# EasyEDA Pro project 灯光画控制板.epro

# Schematic 灯光画控制板
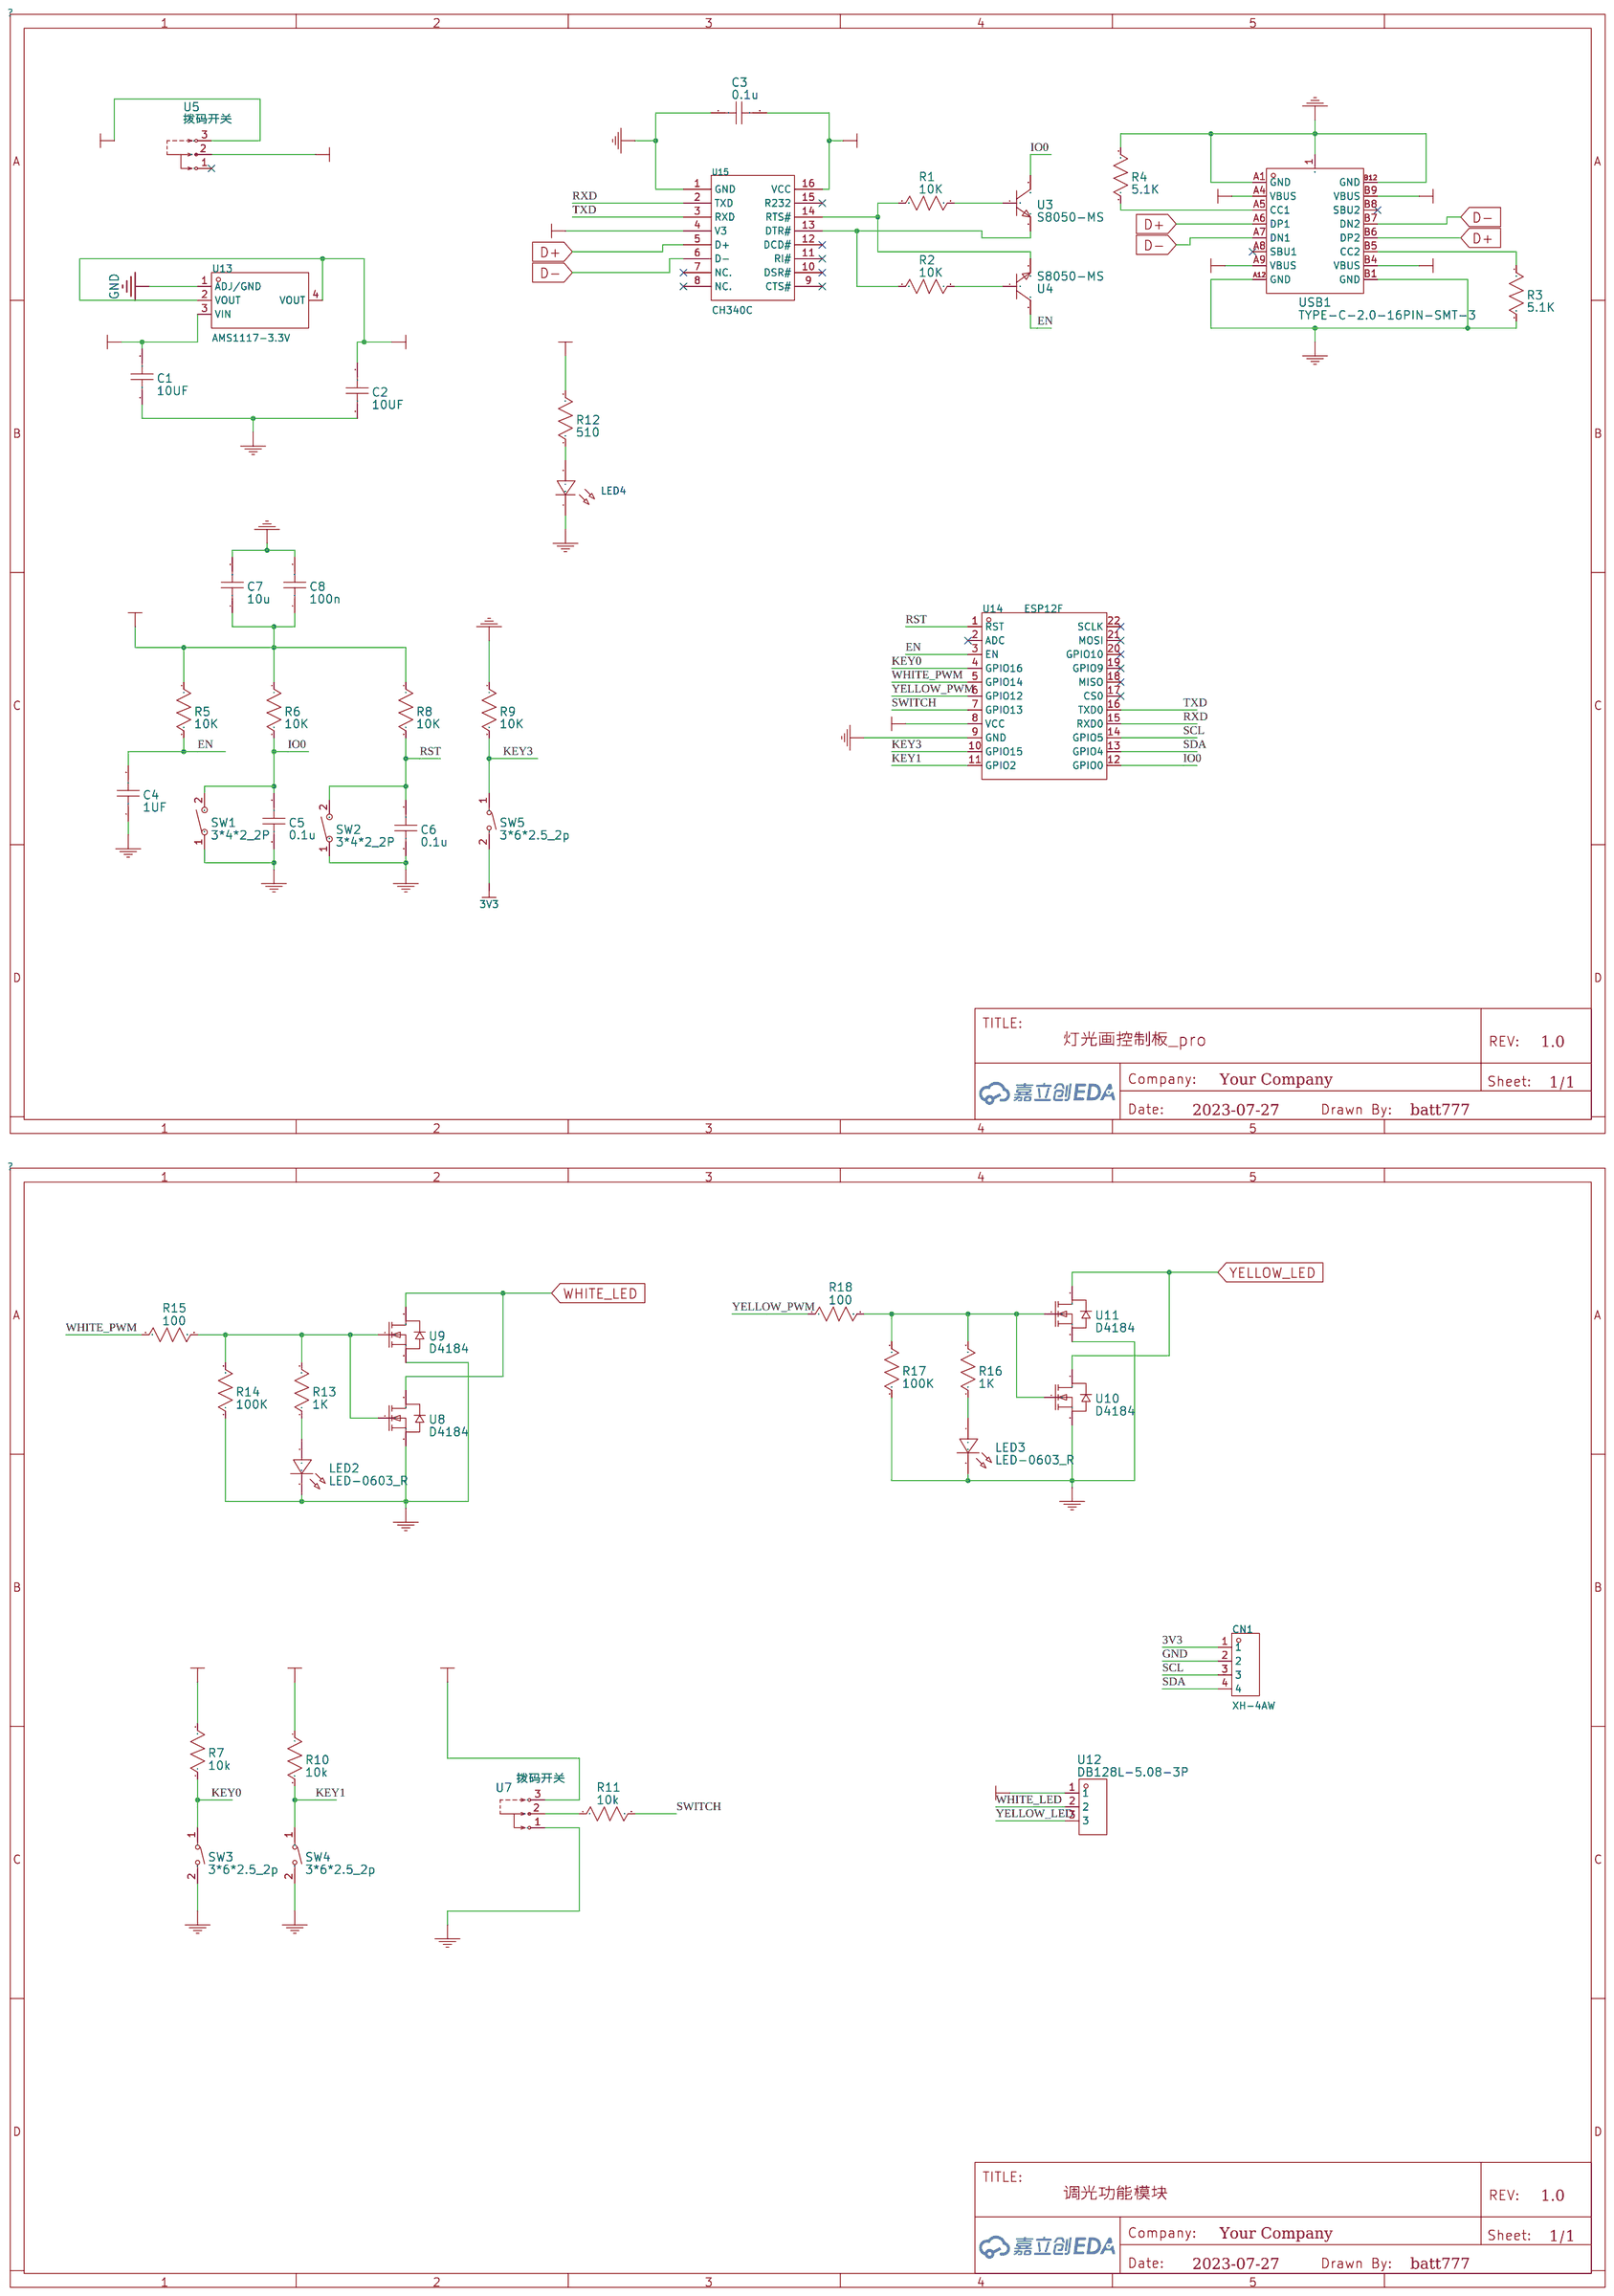
[diagram p0: schematic sheet]

## Parts
C1  10UF  [C0603]
C2  10UF  [C0603]
C3  0.1u  [C0603]
C4  1UF  [C0603]
C5  0.1u  [C0603]
C6  0.1u  [C0603]
C7  10u  [C0603]
C8  100n  [C0603]
CN1  XH-4AW  [CONN-TH_XH-4AW]
LED2  LED-0603_R  [LED0603_RED]
LED3  LED-0603_R  [LED0603_RED]
LED4  -  [LED_0603]
R1  10K  [R0603]
R2  10K  [R0603]
R3  5.1K  [R0603]
R4  5.1K  [R0603]
R5  10K  [R0603]
R6  10K  [R0603]
R7  10k  [R0603]
R8  10K  [R0603]
R9  10K  [R0603]
R10  10k  [R0603]
R11  10k  [R0603]
R12  510  [R0603]
R13  1K  [R0603]
R14  100K  [R0603]
R15  100  [R0603]
R16  1K  [R0603]
R17  100K  [R0603]
R18  100  [R0603]
SW1  3*4*2_2P  [SW-SMD_L4.0-W2.9-LS5.0]
SW2  3*4*2_2P  [SW-SMD_L4.0-W2.9-LS5.0]
SW3  3*6*2.5_2p  [SW-SMD_L6.1-W3.5-LS8.0]
SW4  3*6*2.5_2p  [SW-SMD_L6.1-W3.5-LS8.0]
SW5  3*6*2.5_2p  [SW-SMD_L6.1-W3.5-LS8.0]
U3  S8050-MS  [SOT-23-3_L2.9-W1.3-P1.90-LS2.4-BR]
U4  S8050-MS  [SOT-23-3_L2.9-W1.3-P1.90-LS2.4-BR]
U5  拨码开关  [SW-TH_SHOU-HAN_SS12D10G4]
U7  拨码开关  [SW-TH_SHOU-HAN_SS12D10G4]
U8  D4184  [TO-252-3_L6.6-W6.1-P4.57-LS9.9-BR-CW]
U9  D4184  [TO-252-3_L6.6-W6.1-P4.57-LS9.9-BR-CW]
U10  D4184  [TO-252-3_L6.6-W6.1-P4.57-LS9.9-BR-CW]
U11  D4184  [TO-252-3_L6.6-W6.1-P4.57-LS9.9-BR-CW]
U12  DB128L-5.08-3P  [CONN-TH_DB128L-5.08-3P]
U13  AMS1117-3.3V  [SOT-223-4_L6.5-W3.5-P2.30-LS7.0-BR]
U14  ESP12F  [WIFIM-SMD_ESP-12F-ESP8266MOD]
U15  CH340C  [SOP-16_L10.0-W3.9-P1.27-LS6.0-BL]
USB1  TYPE-C-2.0-16PIN-SMT-3  [TYPE-C-SMD_TYPE-CF3.1]

## Library data of the parts
C1 C2 = 22UF
C3 C5 C6 = 0.1u
C4 = 1UF
C7 = 10u
C8 = 100n
CN1 = XH-4AW: 参考系列:XH;间距:2.54mm;插针结构:1x4P;排数:1;每排PIN数:4;行距:-;公母:公型插针;安装方式:弯插;额定电流:3A;工作温度范围:-25℃~+85℃;; LCSC Part Name: XH 2.54mm 1x4P 弯插; Supplier Part: C2908613; Manufacturer: HCTL(华灿天禄); Supplier Footprint: 插件,P=2.54mm; JLCPCB Part Class: 扩展库; Datasheet: https://atta.szlcsc.com/upload/public/pdf/source/20211021/ACA2D54D99493880102FCACAC8DAABA8.pdf; Supplier: LCSC; Reference Series: XH; Pitch: 2.54mm; Pins Structure: 1x4P; Number of Rows: 1; Number of PINs Per Row: 4; Gender: 公型插针; Mounting Style: 弯插; Current Rating (Max): 3A; Operating Temperature Range: -25℃~+85℃
LED2 LED3 = LED-0603_R: Manufacturer: EVERLIGHT(台湾亿光); Manufacturer Part: 19-217/R6C-AL1M2VY/3T; Supplier Part: C72044; Supplier: LCSC
LED4 = LED_0603-B: Supplier Footprint: 0603
R1 R2 R5 R6 R8 R9 = 10K
R3 R4 = 5.1K
R7 R10 R11 = 10k
R12 = 510
R13 R16 = 1K
R14 R17 = 100K
R15 R18 = 100
SW1 SW2 = 3*4*2_2P: Supplier: LCSC; Supplier Part: C557591; Manufacturer: SHOU HAN(首韩); JLCPCB Part Class: Extended Part
SW3-SW5 = 3*6*2.5_2p: Supplier: LCSC; Supplier Part: C5117870; Manufacturer: G-Switch(品赞); Manufacturer Part: GT-TC060A-H025-L1; JLCPCB Part Class: Extended Part
U3 U4 = S8050-MS: Supplier: LCSC; Supplier Part: C5120746; Manufacturer: MSKSEMI(美森科); JLCPCB Part Class: Extended Part
U5 U7 = 拨码开关: Supplier: LCSC; Supplier Part: C5149841; Manufacturer: hanxia(韩下); Manufacturer Part: HX SS12D10G4; JLCPCB Part Class: Extended Part
U8-U11 = D4184: Supplier: LCSC; Supplier Part: C5370959; Manufacturer: TECH PUBLIC(台舟); JLCPCB Part Class: Extended Part
U12 = DB128L-5.08-3P: Supplier: LCSC; Supplier Part: C395869; Manufacturer: DIBO(地博电气); Manufacturer Part: DB128L-5.08-3P-GN-S; JLCPCB Part Class: Extended Part
U13 = AMS1117-3.3V_C2688239: Supplier Part: C2688239; Manufacturer: WPMtek(维攀微); Supplier Footprint: SOT-223-3L; JLCPCB Part Class: 扩展库; Datasheet: https://atta.szlcsc.com/upload/public/pdf/source/20210222/C2688238_4D3372031123CD29F4EA03A9369A9BC4.pdf; Supplier: LCSC
U14 = ESP-12F(ESP8266MOD): 频率:2.4GHz;发射功率:16dBm;核心处理器:ESP8266;天线形式:PCB 板载天线;接收灵敏度:-90dBm;; LCSC Part Name: 完整的802.11b/g/n Wi-Fi的SoC模块; Supplier Part: C82891; Manufacturer: Ai-Thinker(安信可); Supplier Footprint: SMD,16x24mm; JLCPCB Part Class: 扩展库; Datasheet: https://atta.szlcsc.com/upload/public/pdf/source/20210219/C82891_ABD84A460F4F056A2757267CCCA4B508.pdf; Supplier: LCSC; Output Power: 16dBm; Core Processor: ESP8266; Support Interface: GPIO；UART；I2C；PWM；SPI；ADC; Antenna Type: PCB 板载天线; Wireless Standard: 802.11b/g/n; Operating Voltage: 3.3V; Receive  Current: 120mA; Send  Current: 170mA; Sensitivity: -90dBm; Operating Temperature: -40℃~+85℃
U15 = CH340C: 应用功能:收发器;接口协议:USB 2.0;数据速率:2Mbps;; LCSC Part Name: CH340C USB转串口芯片 CH340; Supplier Part: C84681; Manufacturer: WCH(南京沁恒); Supplier Footprint: SOP-16; JLCPCB Part Class: 扩展库; Datasheet: https://atta.szlcsc.com/upload/public/pdf/source/20200819/C84681_ADBED554CE321879DBD6B1D06488689C.pdf; Supplier: LCSC; Applications Function: 收发器; Protocol: USB 2.0; Data Rate: 2Mbps; Supply Voltage: 3.3V；5V
USB1 = TYPE-C-2.0-16PIN-SMT-3: Supplier: LCSC; Supplier Part: C2987386; Manufacturer: CIKI(皓富); JLCPCB Part Class: Extended Part

## Nets
3V3: C2.2 C3.2 C7.1 C8.1 CN1.1 R5.1 R6.1 R7.2 R8.1 R10.1 R12.2 SW5.2 U7.3 U13.2(VOUT) U13.4(VOUT) U14.8(VCC) U15.4(V3) U15.16(VCC)
5V_OUT: U5.3 USB1.A4(VBUS) USB1.A9(VBUS) USB1.B4(VBUS) USB1.B9(VBUS)
+5V: C1.2 U5.2 U12.1 U13.3(VIN)
GND: C1.1 C2.1 C3.1 C4.1 C5.1 C6.1 C7.2 C8.2 CN1.2 LED2.2 LED3.2 LED4.1(C) R3.1 R4.2 R9.1 R14.1 R17.1 SW1.1 SW2.1 SW3.2 SW4.2 U7.1 U8.3(S) U9.3(S) U10.3(S) U11.3(S) U13.1(ADJ/GND) U14.9(GND) U15.1(GND) USB1.1(EH) USB1.A1(GND) USB1.A12(GND) USB1.B1(GND) USB1.B12(GND)
D+: U15.5(D+) USB1.A6(DP1) USB1.B6(DP2)
D-: U15.6(D-) USB1.A7(DN1) USB1.B7(DN2)
EN: C4.2 R5.2 U4.3(C) U14.3(EN)
IO0: C5.2 R6.2 SW1.2 U3.3(C) U14.12(GPIO0)
KEY0: R7.1 SW3.1 U14.4(GPIO16)
KEY1: R10.2 SW4.1 U14.11(GPIO2)
KEY3: R9.2 SW5.1 U14.10(GPIO15)
RST: C6.2 R8.2 SW2.2 U14.1(RST)
RXD: U14.15(RXD0) U15.2(TXD)
SCL: CN1.3 U14.14(GPIO5)
SDA: CN1.4 U14.13(GPIO4)
SWITCH: R11.2 U14.7(GPIO13)
TXD: U14.16(TXD0) U15.3(RXD)
WHITE_LED: U8.2(D) U9.2(D) U12.2
WHITE_PWM: R15.1 U14.5(GPIO14)
YELLOW_LED: U10.2(D) U11.2(D) U12.3
YELLOW_PWM: R18.1 U14.6(GPIO12)
$1N163: R1.2 U3.1(B)
$1N164: R1.1 U4.2(E) U15.14(RTS#)
$1N165: R2.2 U4.1(B)
$1N282: R4.1 USB1.A5(CC1)
$1N283: R3.2 USB1.B5(CC2)
$1N459: LED2.1 R13.1
$1N460: R13.2 R14.2 R15.2 U8.1(G) U9.1(G)
$1N558: LED3.1 R16.1
$1N559: R16.2 R17.2 R18.2 U10.1(G) U11.1(G)
$1N881: R11.1 U7.2
$1N1829: LED4.2(A) R12.1
$1N4236: R2.1 U3.2(E) U15.13(DTR#)

Not connected (* = marked no-connect by the designer): U5 1*; U14 2(ADC)* 17(CS0)* 18(MISO)* 19(GPIO9)* 20(GPIO10)* 21(MOSI)* 22(SCLK)*; U15 7(NC.)* 8(NC.)* 9(CTS#)* 10(DSR#)* 11(RI#)* 12(DCD#)* 15(R232)*; USB1 A8(SBU1)* B8(SBU2)*

# Board PCB_灯光画控制板
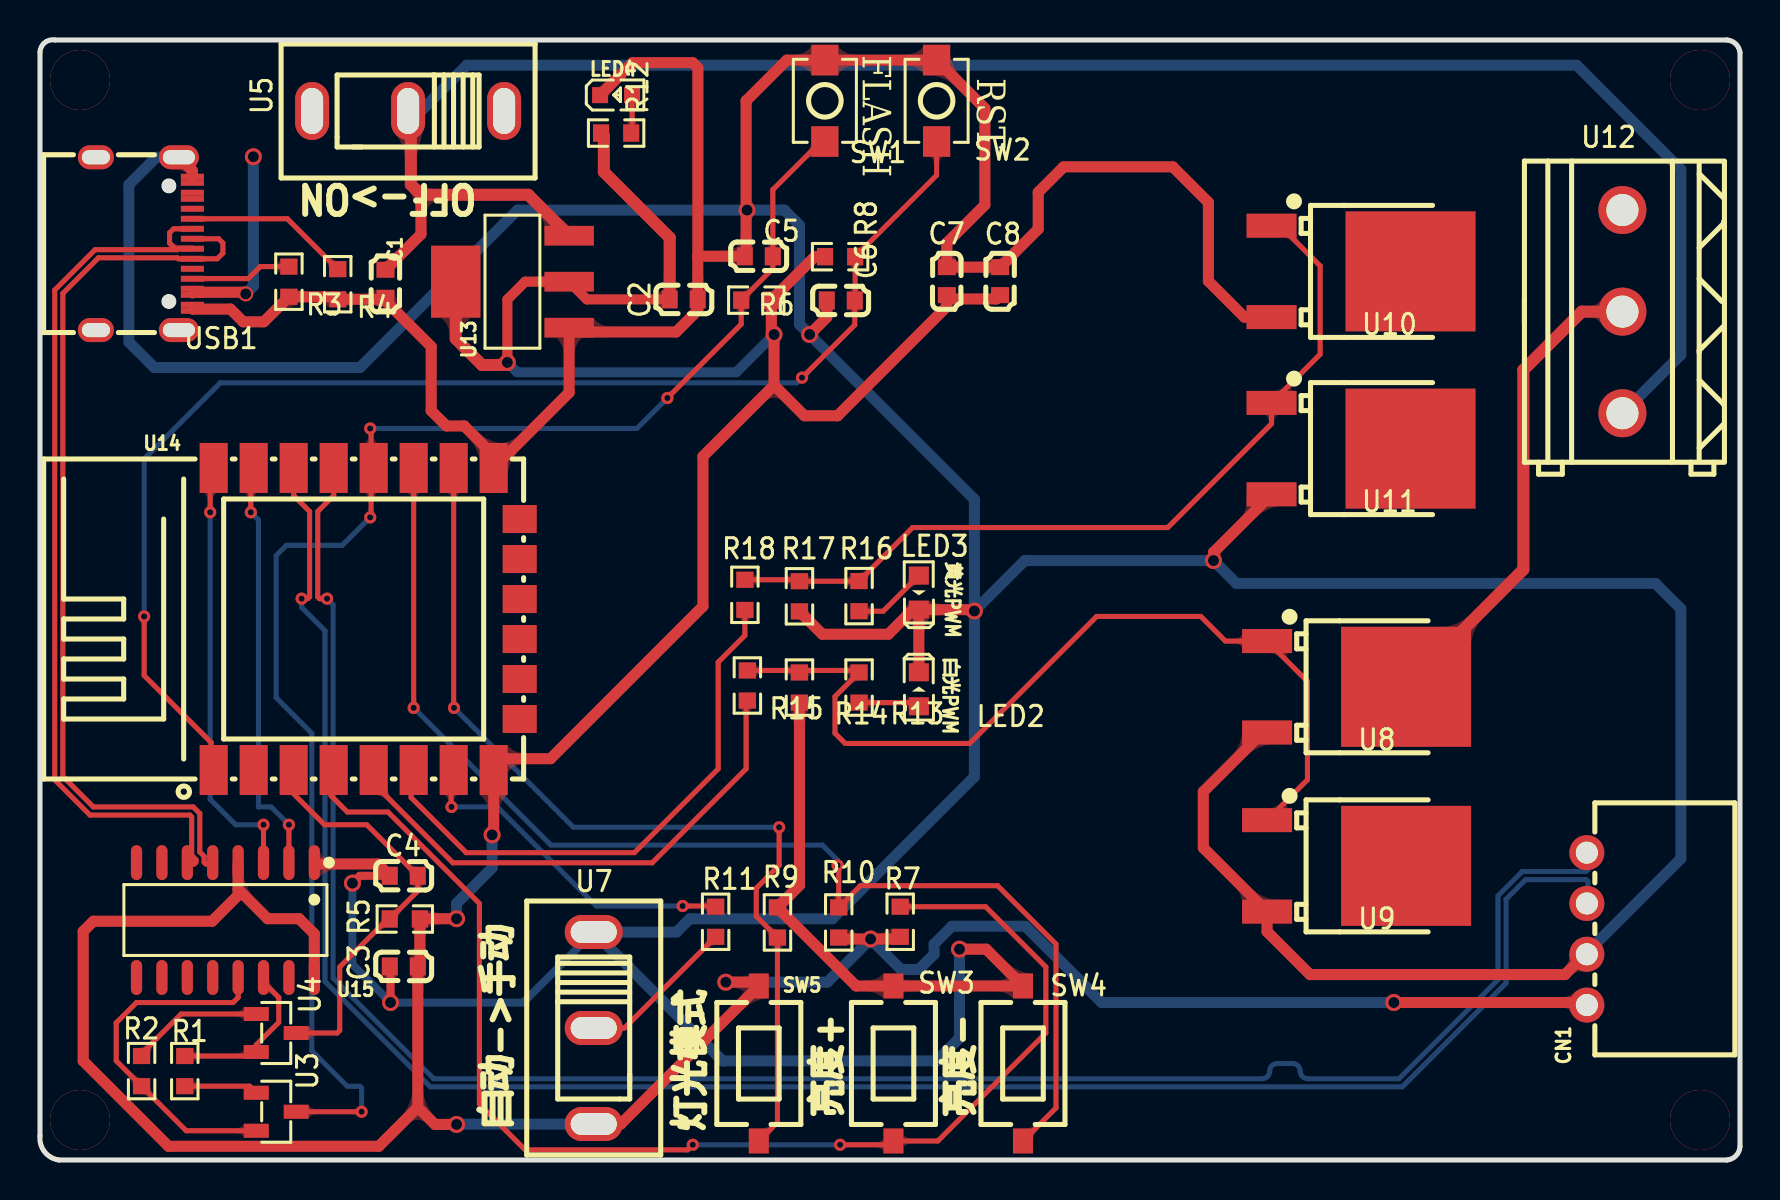
[diagram p1: board, top side]
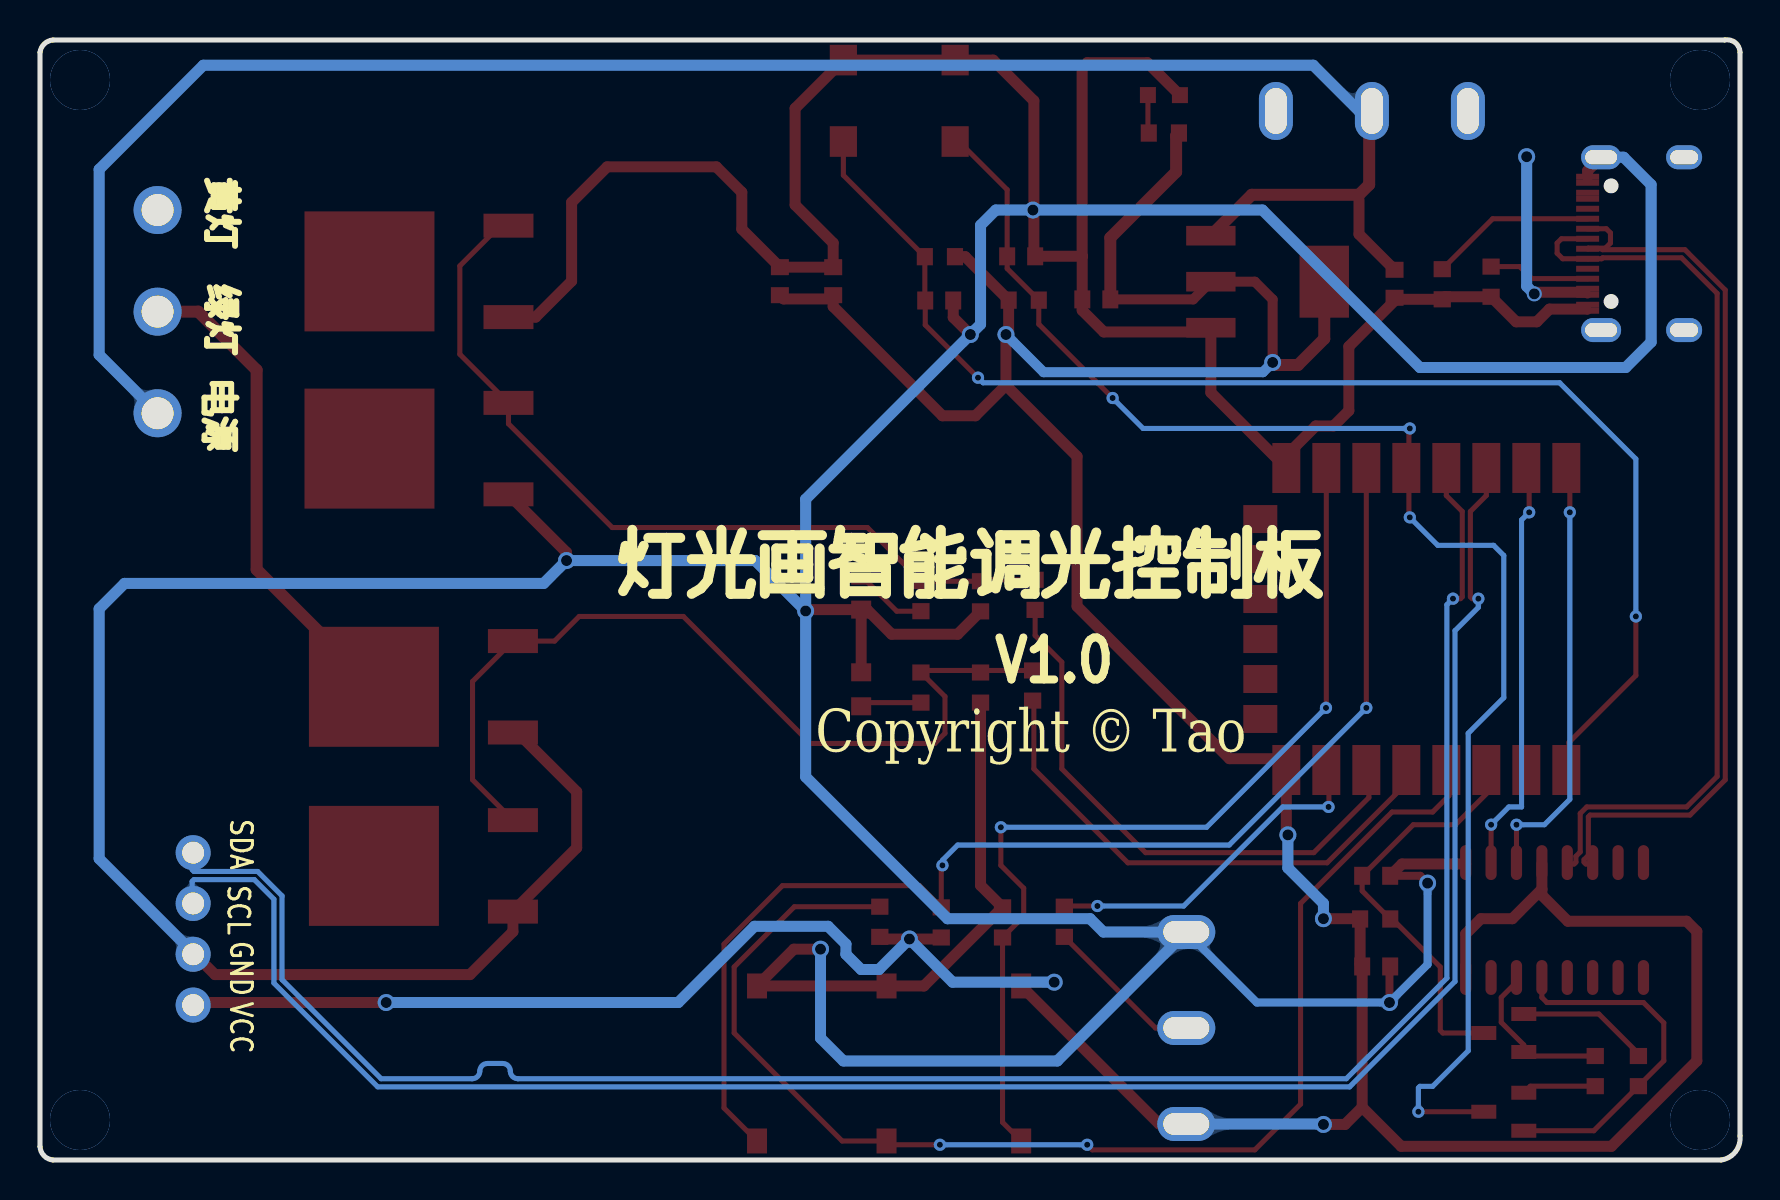
[diagram p2: board, bottom side, seen from below]

Outline 85 x 56 mm; copper layers: Top Layer, Bottom Layer. Coordinates in mm from the lower left corner of the outline.
Outline path: 0,55.39 arc(0.24,55.87) 0.76,56 84.35,56 arc(84.79,55.81) 85,55.38 85,0.67 arc(84.8,0.22) 84.35,0 0.94,0 arc(0.23,0.41) 0,1.21 0,55.39
Stack: Top Layer 0.035mm / Dielectric1 1.51mm FR4 er 4.5 / Bottom Layer 0.035mm

## Design rules (mm)
net SDA: DP2
net SCL: DP2
net D+: DP1
net D-: DP1
template: 用户自定义配置
spacing Default (default): track to track 0.152, other pairs 0 to 0.152
track width Default (default): min 0.254, default 0.254, max 0.254
track width POWER: min 0.35, default 0.55, max 0.6
track width GND: min 0.4, default 0.6, max 0.65
differential pair differentialPair (default): width min 0.127, default 0.254, max 2.54; gap min 0.152, default 0.152
via Default (default): diameter min 0.61, default 0.61, max 100.025; hole min 0.305, default 0.305, max 59.995
net +5V uses POWER
net GND uses GND
net 3V3 uses POWER
net 5V_OUT uses POWER
net WHITE_LED uses GND

## Placement (name value [footprint] x y rotation side)
C1  10UF  [C0603]  17.27 43.81 90 top
C2  10UF  [C0603]  32.18 43.03 180 top
C3  0.1u  [C0603]  18.19 9.68 0 top
C4  1UF  [C0603]  18.19 14.21 0 top
C5  0.1u  [C0603]  35.94 45.18 0 top
C6  0.1u  [C0603]  40.04 42.98 0 top
C7  10u  [C0603]  45.34 43.94 90 top
C8  100n  [C0603]  48.01 43.94 90 top
CN1  XH-4AW  [CONN-TH_XH-4AW]  77.34 11.56 90 top
LED2  LED-0603_R  [LED0603_RED]  43.94 23.54 90 top
LED3  LED-0603_R  [LED0603_RED]  43.94 28.37 270 top
LED4  -  [LED_0603]  28.85 53.25 0 top
R1  10K  [R0603]  7.24 4.44 270 top
R2  10K  [R0603]  5.08 4.44 90 top
R3  5.1K  [R0603]  12.45 43.92 90 top
R4  5.1K  [R0603]  14.89 43.79 270 top
R5  10K  [R0603]  18.24 12.05 180 top
R6  10K  [R0603]  35.81 42.99 180 top
R7  10k  [R0603]  43.01 11.91 270 top
R8  10K  [R0603]  40 45.17 0 top
R9  10K  [R0603]  36.87 11.88 270 top
R10  10k  [R0603]  39.94 11.88 90 top
R11  10k  [R0603]  33.78 11.91 90 top
R12  510  [R0603]  28.81 51.35 180 top
R13  1K  [R0603]  40.95 23.62 90 top
R14  100K  [R0603]  37.97 23.62 90 top
R15  100  [R0603]  35.37 23.72 90 top
R16  1K  [R0603]  40.95 28.19 90 top
R17  100K  [R0603]  37.97 28.19 90 top
R18  100  [R0603]  35.24 28.26 90 top
SW1  3*4*2_2P  [SW-SMD_L4.0-W2.9-LS5.0]  39.24 52.96 270 top
SW2  3*4*2_2P  [SW-SMD_L4.0-W2.9-LS5.0]  44.83 52.96 270 top
SW3  3*6*2.5_2p  [SW-SMD_L6.1-W3.5-LS8.0]  42.67 4.83 90 top
SW4  3*6*2.5_2p  [SW-SMD_L6.1-W3.5-LS8.0]  49.15 4.83 90 top
SW5  3*6*2.5_2p  [SW-SMD_L6.1-W3.5-LS8.0]  35.94 4.83 90 top
U3  S8050-MS  [SOT-23-3_L2.9-W1.3-P1.90-LS2.4-BR]  11.81 2.41 180 top
U4  S8050-MS  [SOT-23-3_L2.9-W1.3-P1.90-LS2.4-BR]  11.81 6.35 180 top
U5  拨码开关  [SW-TH_SHOU-HAN_SS12D10G4]  18.41 52.45 180 top
U7  拨码开关  [SW-TH_SHOU-HAN_SS12D10G4]  27.69 6.6 270 top
U8  D4184  [TO-252-3_L6.6-W6.1-P4.57-LS9.9-BR-CW]  64.83 23.66 180 top
U9  D4184  [TO-252-3_L6.6-W6.1-P4.57-LS9.9-BR-CW]  64.83 14.71 180 top
U10  D4184  [TO-252-3_L6.6-W6.1-P4.57-LS9.9-BR-CW]  65.05 44.43 180 top
U11  D4184  [TO-252-3_L6.6-W6.1-P4.57-LS9.9-BR-CW]  65.05 35.57 180 top
U12  DB128L-5.08-3P  [CONN-TH_DB128L-5.08-3P]  79.12 42.42 90 top
U13  AMS1117-3.3V  [SOT-223-4_L6.5-W3.5-P2.30-LS7.0-BR]  23.62 43.92 0 top
U14  ESP12F  [WIFIM-SMD_ESP-12F-ESP8266MOD]  16.33 27.05 0 top
U15  CH340C  [SOP-16_L10.0-W3.9-P1.27-LS6.0-BL]  9.27 12 180 top
USB1  TYPE-C-2.0-16PIN-SMT-3  [TYPE-C-SMD_TYPE-CF3.1]  5.21 45.82 270 top

## Footprints (pads in the part's own frame, mm; a bottom-side part is the same pattern mirrored in y, then rotated)
C0603
  rect 0.8x0.9 smd: 1(-0.7,0) 2(0.7,0)
CONN-TH_DB128L-5.08-3P
  round 2.4 hole 1.6: 1(-5.08,0) 2(0,0) 3(5.08,0)
CONN-TH_XH-4AW
  round 1.75 hole 1.1: 1(-3.81,0) 2(-1.27,0) 3(1.27,0) 4(3.81,0)
LED0603_RED
  rect 0.9x1 smd: 1(-0.85,0) 2(0.85,0)
LED_0603
  rect 0.8x0.8 smd: 1(-0.851,-0.01) 2(0.75,-0.005)
R0603
  rect 0.806x0.864 smd: 1(-0.753,0) 2(0.753,0)
SOP-16_L10.0-W3.9-P1.27-LS6.0-BL
  oval 0.56x1.745 smd: 1(-4.445,-2.873) 2(-3.175,-2.873) 3(-1.905,-2.873) 4(-0.635,-2.873) 5(0.635,-2.873) 6(1.905,-2.873) 7(3.175,-2.873) 8(4.445,-2.873) 9(4.445,2.873) 10(3.175,2.873) 11(1.905,2.873) 12(0.635,2.873) 13(-0.635,2.873) 14(-1.905,2.873) 15(-3.175,2.873) 16(-4.445,2.873)
SOT-23-3_L2.9-W1.3-P1.90-LS2.4-BR
  rect 1.25x0.7 smd: 1(1,-0.95) 2(1,0.95) 3(-1,0)
SOT-223-4_L6.5-W3.5-P2.30-LS7.0-BR
  rect 2.47x0.98 smd: 1(2.835,-2.3) 2(2.835,0) 3(2.835,2.3)
  rect 2.47x3.6 smd: 4(-2.835,0)
SW-SMD_L4.0-W2.9-LS5.0
  rect 1.53x1.36 smd: 1(-2.035,0) 2(2.035,0)
SW-SMD_L6.1-W3.5-LS8.0
  rect 1.25x1 smd: 1(-3.875,0) 2(3.875,0)
SW-TH_SHOU-HAN_SS12D10G4
  oval 1.7x2.9 hole 1.1x2.3: 1(-4.8,0) 2(0,0) 3(4.8,0)
TO-252-3_L6.6-W6.1-P4.57-LS9.9-BR-CW
  rect 2.5x1.2 smd: 1(3.475,-2.286) 3(3.475,2.286)
  rect 6.5x6 smd: 2(-3.475,0)
TYPE-C-SMD_TYPE-CF3.1
  oval 1.2x2 hole 0.7x1.6: 1(-4.32,1.738) 2(4.32,1.738)
  oval 1.2x1.8 hole 0.7x1.4: 3(4.32,-2.413) 4(-4.32,-2.413)
  rect 0.3x1.15 smd: A1(-3.345,2.413) A4(-2.545,2.413) A5(-1.245,2.413) A6(-0.245,2.413) A7(0.255,2.413) A8(1.255,2.413) A9(2.555,2.413) A12(3.355,2.413) B1(3.055,2.413) B4(2.255,2.413) B5(1.755,2.413) B6(0.755,2.413) B7(-0.745,2.413) B8(-1.745,2.413) B9(-2.245,2.413) B12(-3.045,2.413)
WIFIM-SMD_ESP-12F-ESP8266MOD
  rect 1.4x2.5 smd: 1(-7.651,-7.551) 2(-5.651,-7.551) 3(-3.651,-7.551) 4(-1.651,-7.551) 5(0.349,-7.551) 6(2.349,-7.551) 7(4.349,-7.551) 8(6.349,-7.551) 9(6.349,7.548) 10(4.349,7.55) 11(2.349,7.551) 12(0.349,7.551) 13(-1.651,7.55) 14(-3.651,7.551) 15(-5.651,7.551) 16(-7.651,7.551)
  rect 1.7x1.4 smd: 17(7.651,-5) 18(7.649,-3.002) 19(7.649,-1.004) 20(7.649,0.998) 21(7.649,2.997) 22(7.651,4.997)

## Nets
As in the schematic.

Pads without a net: U5 1; U14 2 17 18 19 20 21 22; U15 7 8 9 10 11 12 15; USB1 2 3 4 A8 B8

## Via types
v1: diameter 3, hole 3, Top Layer to Bottom Layer, 4 vias
v2: diameter 0.85, hole 0.55, Top Layer to Bottom Layer, 16 vias
v3: diameter 0.61, hole 0.305, Top Layer to Bottom Layer, 20 vias
v4: diameter 0.75, hole 0.55, Top Layer to Bottom Layer, 1 via

## Routing (per net, layer and track width the routed paths; a pad name or vN(x,y) marks a point on that pad's centre or on a via; arc(x,y) is an arc through that point)
3V3: length 225.6
  Top Layer w0.5: v2(23.37,39.88) 23.37,43.03 24.26,43.92 26.46,43.92 27.34,43.03 C2.2
  Top Layer w0.55: 18.89,2.64 C3.2 18.99,9.78 R5.1 19.01,12.06 v2(20.83,12.06) ; 18.89,2.64 19.75,1.78 v2(20.83,1.78) ; 18.89,2.64 16.94,0.69 6.43,0.69 2.16,4.95 2.16,11.43 2.67,11.94 8.61,11.94 9.91,13.24 9.91,13.54 ; 9.91,13.54 11.38,12.06 12.95,12.06 13.72,11.3 13.72,9.33 ; 9.91,13.54 9.91,14.8 ; v2(34.29,8.89) 35.75,8.89 SW5.2 29.04,1.8 U7.3 ; 36.7,38.73 v2(36.7,41.28) 36.57,41.41 R6.1 38.74,45.17 R8.1 ; 36.7,38.73 33.15,35.18 33.15,27.69 25.53,20.07 23.25,20.07 U14.8 22.68,16.33 v2(22.61,16.26) ; 36.7,38.73 38.23,37.21 39.88,37.21 45.34,42.67 C7.1 ; R10.1 40.01,11.05 v2(41.53,11.05) 42.9,11.05 R7.2 ; v2(67.69,7.87) 77.39,7.87 ; C8.1 47.82,43.05 45.59,43.05
  Top Layer w0.6: v2(23.37,39.88) 23.24,39.75 22.1,39.75 20.79,41.06 U13.4 ; R12.2 28.19,51.21 28.19,49.4 31.48,46.11 C2.2
  Bottom Layer w0.5: v2(36.7,41.28) 34.82,39.39 23.86,39.39 v2(23.37,39.88)
  Bottom Layer w0.55: v2(67.69,7.87) 53.09,7.87 49.28,11.68 45.59,11.68 44.7,10.8 44.7,10.29 43.94,9.53 43.05,9.53 v2(41.53,11.05) 39.37,8.89 v2(34.29,8.89) ; v2(20.83,12.06) 20.83,12.83 22.61,14.61 v2(22.61,16.26) ; v2(20.83,1.78) 20.85,1.8 U7.3
5V_OUT: length 9.8
  Top Layer w0.38: USB1.A9 7.75,43.39
  Top Layer w0.55: 7.75,43.39 10.2,43.39 v4(10.29,43.31)
  Bottom Layer w0.55: v2(10.67,50.17) 10.67,43.69 v4(10.29,43.31)
+5V: length 97.1
  Top Layer w0.55: C1.2 19.05,46.29 19.05,48.01
  Top Layer w0.6: U5.2 18.54,52.31 18.54,48.77 19.05,48.26 24.41,48.26 26.46,46.22
  Bottom Layer w0.55: U5.2 19.05,52.45 21.34,54.74 76.84,54.74 82.04,49.53 82.04,40.26 U12.1
GND: length 402.6
  Top Layer w0.4: 7.7,42.55 USB1.A12 ; C3.1 17.53,9.64 v2(17.53,7.87) ; C4.1 15.99,14.21 v2(15.62,13.84)
  Top Layer w0.55: 32.89,43.03 32.89,45.18 32.88,45.19 ; 32.89,43.03 C2.1 ; 32.89,43.03 32.89,42.48 31.81,41.4 26.67,41.4 26.46,41.62 26.46,38.37 U14.9 22.68,35.23 21.21,36.7 20.32,36.7 19.56,37.47 19.56,40.67 17.2,43.04 ; 17.2,43.04 C1.1 ; 17.2,43.04 R4.2 14.76,43.16 R3.1 11.19,41.91 10.16,41.91 9.53,42.55 7.7,42.55 ; 13.72,14.8 16.9,14.8 C4.1 ; U10.3 60.22,42.14 58.42,43.94 58.42,47.88 56.64,49.66 51.18,49.66 49.91,48.39 49.91,46.55 C8.2 C7.2 45.34,45.85 47.24,47.75 47.24,52.58 SW2.1 SW1.1 37.34,54.99 35.31,52.96 35.31,45.25 C5.1 35.24,45.19 32.88,45.19 ; U8.3 61.13,21.37 58.17,18.42 58.17,15.61 U9.3 61.35,11.42 63.5,9.27 76.25,9.27 77.39,10.41 ; 32.88,45.19 32.89,45.2 32.89,54.61 32.64,54.86 29.63,54.86 LED4.1 ; LED3.2 46.65,27.52 v2(46.72,27.45) ; LED3.2 LED2.2 ; LED3.2 43.65,27.52 42.42,26.29 39.12,26.29 R17.1 ; v2(38.48,41.28) 39.34,42.13 C6.1 ; USB1.A1 7.62,49.46 USB1.1 ; U11.3 58.67,30.38 v2(58.67,29.97) ; v2(45.97,10.54) 47.31,10.54 SW4.2 SW3.2 40.8,8.7 R9.1 37.97,13.73 R14.1
  Bottom Layer w0.4: v2(15.62,13.84) 15.62,9.78 v2(17.53,7.87) 24.16,7.87 U7.1
  Bottom Layer w0.55: v2(45.97,10.54) 45.97,6.1 44.83,4.95 34.13,4.95 U7.1 31.83,11.4 32.5,12.06 39.62,12.06 46.72,19.16 v2(46.72,27.45) ; 77.39,10.41 82.04,15.06 82.04,27.56 80.77,28.83 59.82,28.83 v2(58.67,29.97) 49.24,29.97 v2(46.72,27.45) ; USB1.1 5.81,50.14 4.44,48.77 4.44,40.89 5.72,39.62 16,39.62 23.88,47.5 v2(35.35,47.5) 37.21,47.5 37.97,46.74 37.97,41.78 v2(38.48,41.28) 46.72,33.04 v2(46.72,27.45)
(no net):
  vias: v1(2,54) v1(2,2) v1(83,54) v1(83,2)
D+: length 45.8
  Top Layer w0.254: USB1.A6 8.93,46.06 9.14,45.85 9.14,45.34 8.87,45.06 USB1.B6 6.92,45.06 6.87,45.11 2.92,45.11 1.14,43.33 1.14,19.18 2.67,17.65 7.66,17.65 7.99,17.33 7.99,15.4 8.2,15.19 8.2,14.89 8.29,14.8 8.64,14.8
D-: length 45.7
  Top Layer w0.254: USB1.B7 6.68,46.56 6.48,46.36 6.48,45.85 6.73,45.59 7.59,45.59 USB1.A7 6.92,45.56 6.87,45.52 2.75,45.52 0.74,43.5 0.74,19.01 2.5,17.25 7.49,17.25 7.58,17.16 7.58,15.23 7.8,15.02 7.8,14.89 7.71,14.8 7.37,14.8
EN: length 20.8
  Top Layer w0.254: 12.56,19.5 12.56,18.43 14.22,16.76 16.34,16.76 C4.2 18.89,13.45 R5.2 17.38,12.05 14.99,9.65 14.99,6.48 14.86,6.35 U4.3
IO0: length 74.9
  Top Layer w0.254: v3(16.51,32.13) 16.56,32.18 16.56,36.53 v3(16.51,36.58) ; U3.3 v3(16.08,2.41) ; SW1.2 39.05,50.92 36.64,48.51 C5.2 36.64,44.57 R6.2 35.06,41.79 v3(31.37,38.1)
  Bottom Layer w0.254: v3(16.08,2.41) 16.08,3.6 16,3.68 15.37,3.68 13.59,5.46 13.59,21.34 11.81,23.11 11.81,30.23 12.32,30.73 15.11,30.73 v3(16.51,32.13) ; v3(16.51,36.58) 29.84,36.58 v3(31.37,38.1)
KEY0: length 64.5
  Top Layer w0.254: R7.1 47.28,12.66 50.29,9.65 50.29,6.35 44.89,0.95 SW3.1 42.48,0.76 v3(40,0.76) ; 14.56,19.5 14.56,18.21 15.37,17.4 17.4,17.4 21.97,12.83 21.97,2.79 24.26,0.51 32.38,0.51 v3(32.64,0.76)
  Bottom Layer w0.254: v3(32.64,0.76) v3(40,0.76)
KEY1: length 61.8
  Top Layer w0.254: v3(39.88,14.73) 39.94,14.67 R10.2 41.02,13.72 47.88,13.72 50.8,10.8 50.8,2.6 SW4.1 ; U14.11 v3(18.68,22.61)
  Bottom Layer w0.254: v3(18.68,22.61) 25.54,15.75 39.12,15.75 39.88,14.99 v3(39.88,14.73)
KEY3: length 47.8
  Top Layer w0.254: SW5.1 36.87,1.88 R9.2 35.81,12.18 35.81,13.59 36.96,14.73 v3(36.96,16.64) ; U14.10 20.68,22.48
  Bottom Layer w0.254: v3(20.7,22.61) 26.67,16.64 v3(36.96,16.64)
RST: length 66.1
  Top Layer w0.254: 8.56,19.5 8.56,20.88 5.21,24.22 v3(5.21,27.18) ; v3(38.1,39.12) 40.74,41.75 C6.2 40.76,43 R8.2 44.83,49.24 SW2.2
  Bottom Layer w0.254: v3(5.21,27.18) 5.21,35.05 9.02,38.86 37.85,38.86 v3(38.1,39.12)
RXD: length 21
  Top Layer w0.254: 12.45,14.8 v3(12.45,16.76) ; 10.56,34.6 10.54,34.59 v3(10.54,32.39)
  Bottom Layer w0.254: v3(12.45,16.76) 11.56,17.65 10.92,17.65 10.92,32 v3(10.54,32.39)
SCL: length 99.9
  Top Layer w0.254: U14.14 12.68,33.22 13.48,32.43 13.48,28.16 13.39,28.07 v3(13.08,28.07)
  Bottom Layer w0.254: v3(13.08,28.07) 13.08,27.64 14.25,26.47 14.25,8.92 19.52,3.66 68.11,3.66 73.3,8.85 73.3,13.04 74.28,14.02 77.3,14.02 77.39,13.93 77.39,12.95
SDA: length 99.8
  Top Layer w0.254: U14.13 14.68,33.22 13.89,32.43 13.89,28.16 13.98,28.07 v3(14.35,28.07)
  Bottom Layer w0.254: 77.39,15.49 77.39,14.52 77.3,14.43 74.12,14.43 72.9,13.21 72.9,9.02 67.94,4.06 63.39,4.06 arc(63.12,4.18) 63.01,4.44 arc(62.9,4.71) 62.63,4.83 61.87,4.83 arc(61.6,4.71) 61.49,4.44 arc(61.37,4.18) 61.1,4.06 19.69,4.06 14.66,9.09 14.66,27.76 v3(14.35,28.07)
SWITCH: length 17.1
  Top Layer w0.254: v3(32.13,12.7) 33.75,12.7 R11.2 ; v3(20.57,17.65) 20.55,17.67 20.55,19.5
  Bottom Layer w0.254: v3(20.57,17.65) 22.86,17.65 27.81,12.7 v3(32.13,12.7)
TXD: length 21.7
  Top Layer w0.254: 11.18,14.8 v3(11.18,16.76) ; 8.56,34.6 8.51,34.56 v3(8.51,32.39)
  Bottom Layer w0.254: v3(8.51,32.39) 8.51,18.03 9.78,16.76 v3(11.18,16.76)
WHITE_LED: length 24.4
  Top Layer w0.6: U12.2 77.09,42.42 74.17,39.5 74.17,29.53 U8.2
WHITE_PWM: length 26.4
  Top Layer w0.254: 16.56,19.5 16.56,18.95 20.65,14.86 30.61,14.86 35.31,19.56 35.31,22.91 R15.1
YELLOW_PWM: length 28.1
  Top Layer w0.254: 18.56,19.5 18.56,18.12 21.31,15.37 29.72,15.37 33.91,19.56 33.91,24.89 35.24,26.23 R18.1
$1N163: length 3.7
  Top Layer w0.254: R1.2 10.48,3.69 U3.1
$1N164: length 8.4
  Top Layer w0.254: 11.18,9.33 11.18,8.89 11.94,8.13 11.94,6.88 10.81,5.75 U4.2 10.61,5.2 R1.1
$1N165: length 6.7
  Top Layer w0.254: U4.1 7.06,7.3 4.96,5.2
$1N282: length 8.3
  Top Layer w0.254: USB1.A5 12.37,47.06 R4.1
$1N283: length 5.1
  Top Layer w0.254: R3.2 11.01,44.67 10.41,44.07 7.63,44.07 USB1.B5
$1N459: length 3.1
  Top Layer w0.254: R13.1 43.76,22.87 LED2.1
$1N460: length 44.9
  Top Layer w0.254: 37.87,24.48 R14.2 ; 37.87,24.48 40.85,24.48 R13.2 39.75,23.17 39.75,21.34 40.26,20.83 46.48,20.83 52.83,27.18 58.04,27.18 59.27,25.95 U8.1 63.37,23.93 63.37,19.01 U9.1 ; 37.87,24.48 R15.2
$1N558: length 3.7
  Top Layer w0.254: R16.1 42.16,27.44 LED3.1
$1N559: length 41.8
  Top Layer w0.254: U10.1 62,46.72 64.01,44.7 64.01,40.29 U11.1 61.58,36.81 56.39,31.62 43.63,31.62 R16.2 40.94,28.94 37.97,28.94 37.9,29.01 R18.2
$1N881: length 8
  Top Layer w0.254: R11.1 29.22,6.6 U7.2
$1N1829: length 1.9
  Top Layer w0.254: LED4.2 29.6,51.39
$1N4236: length 18
  Top Layer w0.254: U3.2 7.31,1.46 R2.1 3.81,4.96 3.81,6.86 4.83,7.87 9.65,7.87 9.91,8.13 U15.13

## Copper pours and planes (outline as drawn; the poured copper is in the pictures)
5V_OUT on Top Layer: 7.62,47.96 13.59,47.96 13.59,52.44 13.61,52.45 9.02,52.45 8.51,51.94 8.51,48.51 7.89,48.51 7.89,48.24
WHITE_LED on Top Layer: 64.01,27.56 64.01,10.29 74.29,10.29 74.42,10.16 74.42,27.56
YELLOW_LED on Top Layer: 79.12,47.5 65.53,47.5 65.41,47.62 65.41,29.97 65.28,29.84 72.26,29.84 72.39,29.97 72.39,44.58 72.71,44.89 79.24,44.89 79.24,47.38

Small or netless copper shapes (teardrops, artwork), in the pictures only: 200 on Top Layer, 53 on Bottom Layer

## Text on the board
Bottom Silkscreen Layer: SDA | GND | VCC | SCL | V1.0 | 黄灯 | 绿灯 | 电源 | Copyright © Tao | 灯光画智能调光控制板
Top Silkscreen Layer: OFF->ON | 白光PWM | 黄光PWM | RST | FLASH | 自动->手动 | 灯光模式 | 亮度+ | 亮度-
